# Altium schematic sheet DAC.SchDoc: xcore.ai Multi Channel Audio
size 408 x 287 mm; DocumentNumber: 3; Revision: 1V1; SheetNumber: 3; SheetTotal: 8
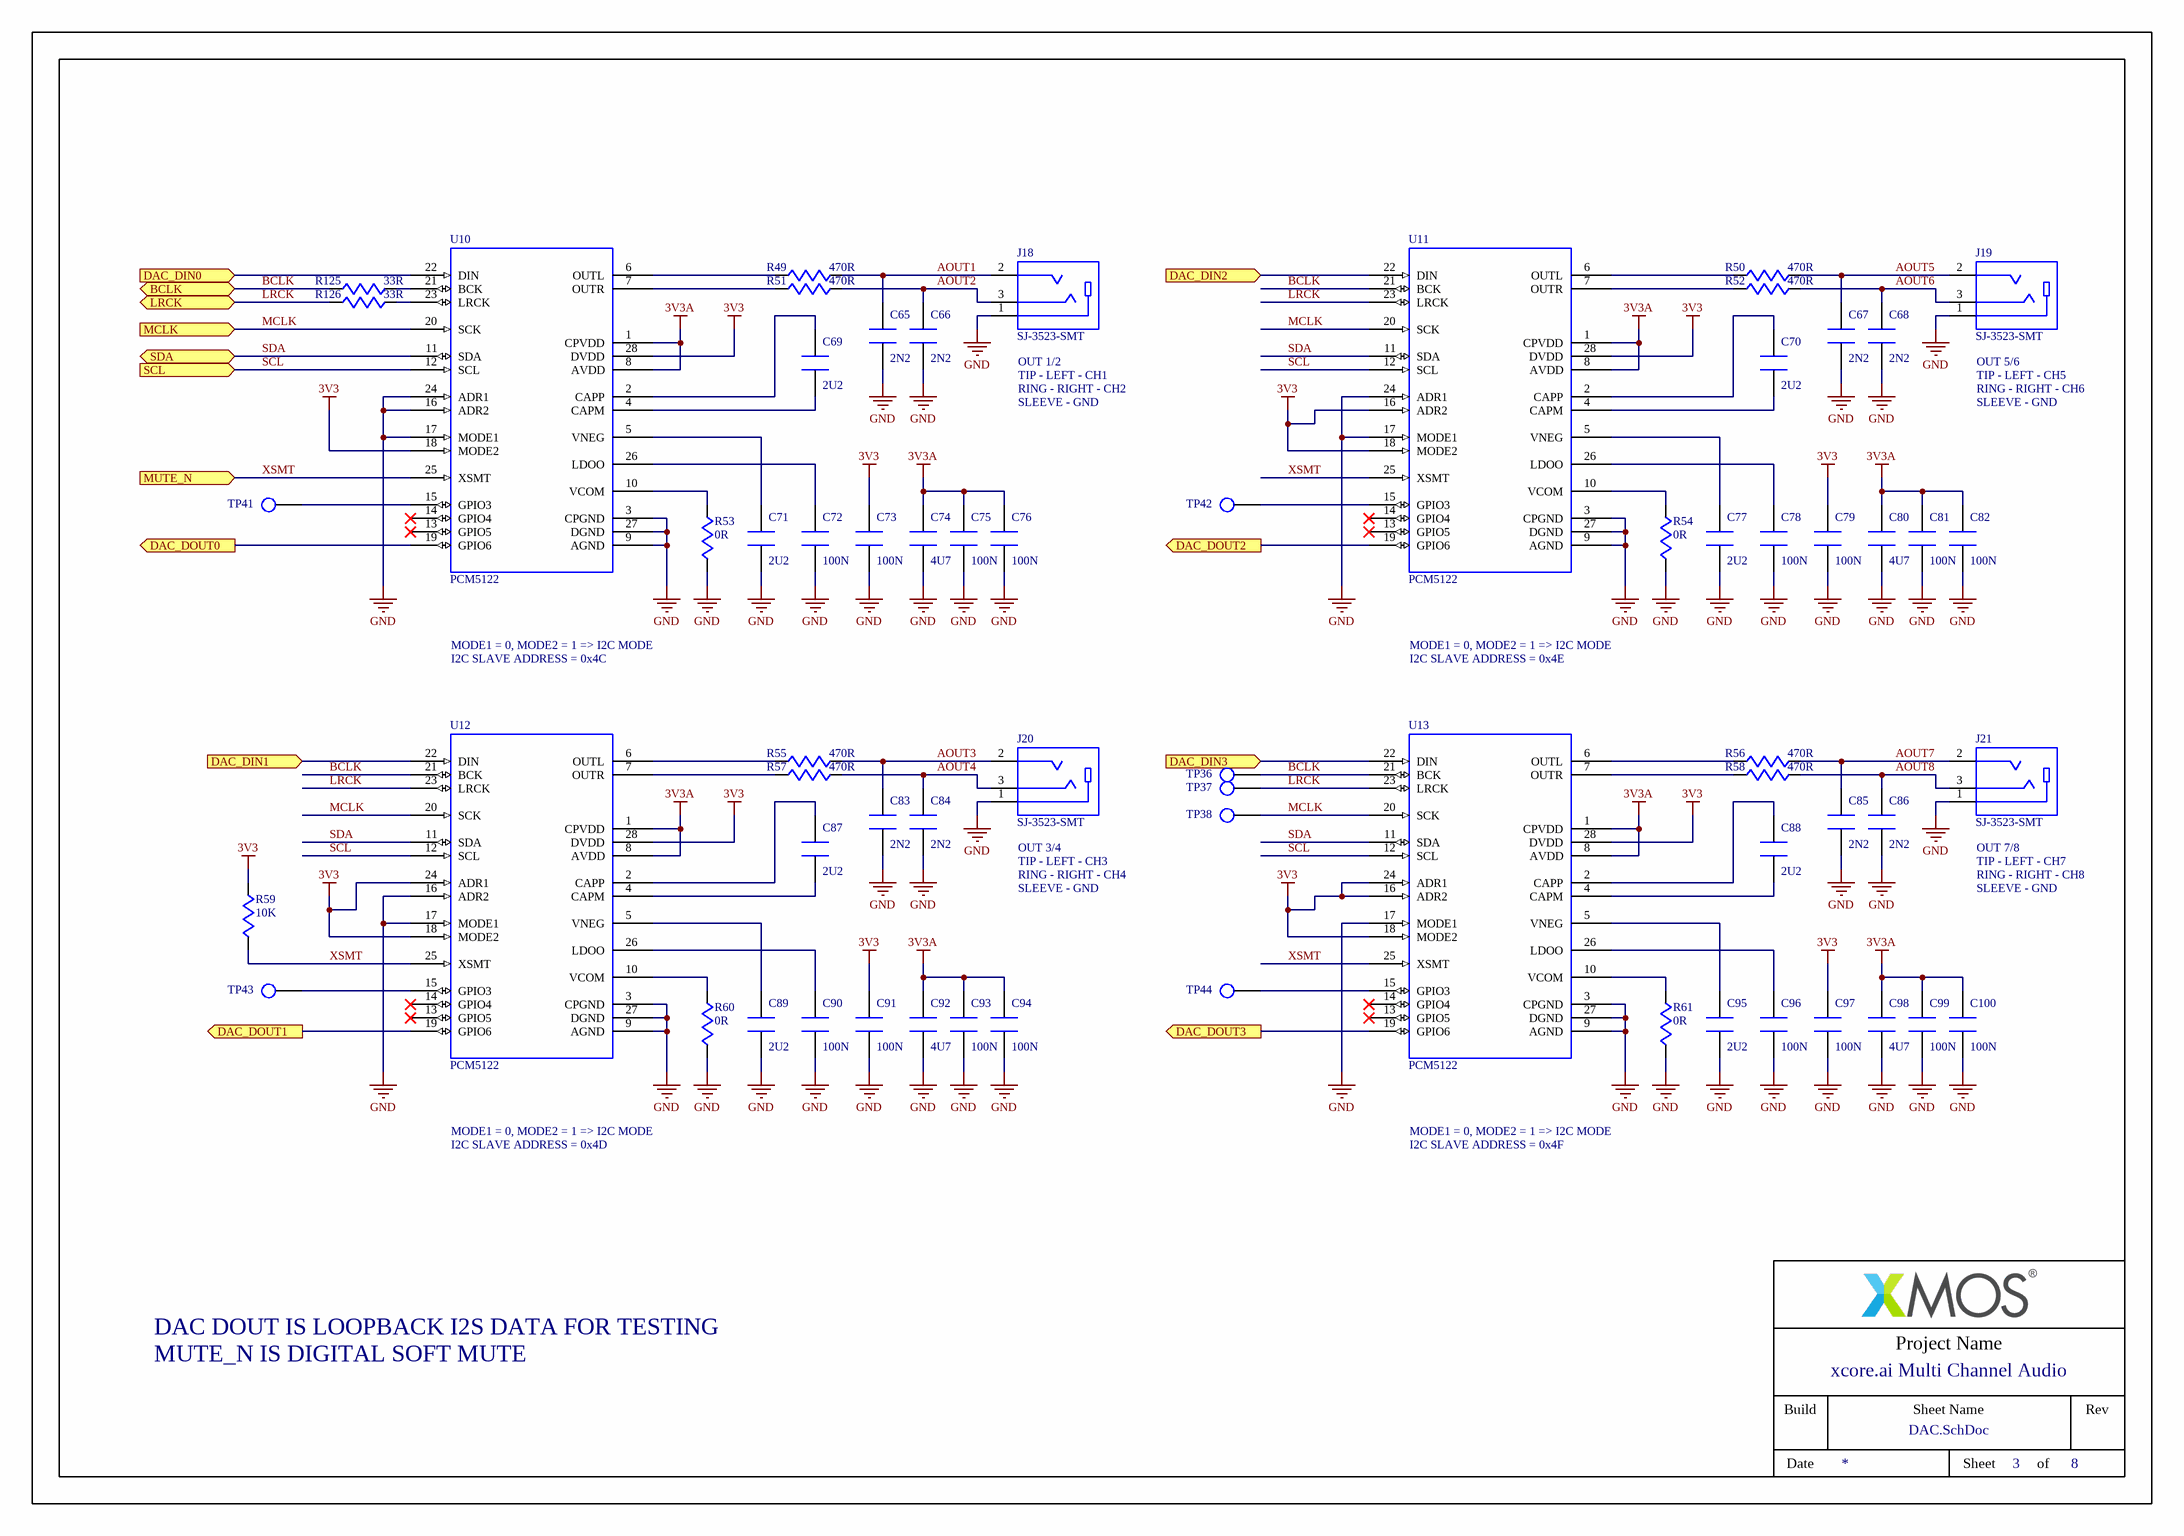
[diagram p0: DAC.SchDoc]

## Parts
C65  2N2  [CAPC1608X90N]
C66  2N2  [CAPC1608X90N]
C67  2N2  [CAPC1608X90N]
C68  2N2  [CAPC1608X90N]
C69  2U2  [CAPC1608X90N]
C70  2U2  [CAPC1608X90N]
C71  2U2  [CAPC1608X90N]
C72  100N  [CAPC1005X55N]
C73  100N  [CAPC1005X55N]
C74  4U7  [CAPC1608X90N]
C75  100N  [CAPC1005X55N]
C76  100N  [CAPC1005X55N]
C77  2U2  [CAPC1608X90N]
C78  100N  [CAPC1005X55N]
C79  100N  [CAPC1005X55N]
C80  4U7  [CAPC1608X90N]
C81  100N  [CAPC1005X55N]
C82  100N  [CAPC1005X55N]
C83  2N2  [CAPC1608X90N]
C84  2N2  [CAPC1608X90N]
C85  2N2  [CAPC1608X90N]
C86  2N2  [CAPC1608X90N]
C87  2U2  [CAPC1608X90N]
C88  2U2  [CAPC1608X90N]
C89  2U2  [CAPC1608X90N]
C90  100N  [CAPC1005X55N]
C91  100N  [CAPC1005X55N]
C92  4U7  [CAPC1608X90N]
C93  100N  [CAPC1005X55N]
C94  100N  [CAPC1005X55N]
C95  2U2  [CAPC1608X90N]
C96  100N  [CAPC1005X55N]
C97  100N  [CAPC1005X55N]
C98  4U7  [CAPC1608X90N]
C99  100N  [CAPC1005X55N]
C100  100N  [CAPC1005X55N]
J18  SJ-3523-SMT  [CON_CUI_SJ3523]
J19  SJ-3523-SMT  [CON_CUI_SJ3523]
J20  SJ-3523-SMT  [CON_CUI_SJ3523]
J21  SJ-3523-SMT  [CON_CUI_SJ3523]
R49  470R  [RESC1608X55N]
R50  470R  [RESC1608X55N]
R51  470R  [RESC1608X55N]
R52  470R  [RESC1608X55N]
R53  0R  [RESC1608X55N]
R54  0R  [RESC1608X55N]
R55  470R  [RESC1608X55N]
R56  470R  [RESC1608X55N]
R57  470R  [RESC1608X55N]
R58  470R  [RESC1608X55N]
R59  10K  [RESC1608X55N]
R60  0R  [RESC1608X55N]
R61  0R  [RESC1608X55N]
R125  33R  [RESC1608X55N]
R126  33R  [RESC1608X55N]
TP36  TESTPOINT  [TESTPOINT_SMD_0.9MM_L]  (value not drawn)  (no BOM)
TP37  TESTPOINT  [TESTPOINT_SMD_0.9MM_L]  (value not drawn)  (no BOM)
TP38  TESTPOINT  [TESTPOINT_SMD_0.9MM_L]  (value not drawn)  (no BOM)
TP41  TESTPOINT  [TESTPOINT_SMD_0.9MM_L]  (value not drawn)  (no BOM)
TP42  TESTPOINT  [TESTPOINT_SMD_0.9MM_L]  (value not drawn)  (no BOM)
TP43  TESTPOINT  [TESTPOINT_SMD_0.9MM_L]  (value not drawn)  (no BOM)
TP44  TESTPOINT  [TESTPOINT_SMD_0.9MM_L]  (value not drawn)  (no BOM)
U10  PCM5122  [SOP65P640X120-28N]
U11  PCM5122  [SOP65P640X120-28N]
U12  PCM5122  [SOP65P640X120-28N]
U13  PCM5122  [SOP65P640X120-28N]

## Ports
BCLK (bidir), DAC_DIN0 (in), DAC_DIN1 (in), DAC_DIN2 (in), DAC_DIN3 (in), DAC_DOUT0 (out), DAC_DOUT1 (out), DAC_DOUT2 (out), DAC_DOUT3 (out), LRCK (bidir), MCLK (in), MUTE_N (in), SCL (in), SDA (bidir)

## Nets
3V3: C73.1 C79.1 C91.1 C97.1 R59.2 U10.18(MODE2) U10.28(DVDD) U11.16(ADR2) U11.18(MODE2) U11.28(DVDD) U12.18(MODE2) U12.24(ADR1) U12.28(DVDD) U13.16(ADR2) U13.18(MODE2) U13.24(ADR1) U13.28(DVDD)
3V3A: C74.1 C75.1 C76.1 C80.1 C81.1 C82.1 C92.1 C93.1 C94.1 C98.1 C99.1 C100.1 U10.1(CPVDD) U10.8(AVDD) U11.1(CPVDD) U11.8(AVDD) U12.1(CPVDD) U12.8(AVDD) U13.1(CPVDD) U13.8(AVDD)
GND: C65.2 C66.2 C67.2 C68.2 C71.2 C72.2 C73.2 C74.2 C75.2 C76.2 C77.2 C78.2 C79.2 C80.2 C81.2 C82.2 C83.2 C84.2 C85.2 C86.2 C89.2 C90.2 C91.2 C92.2 C93.2 C94.2 C95.2 C96.2 C97.2 C98.2 C99.2 C100.2 J18.1 J19.1 J20.1 J21.1 R53.1 R54.1 R60.1 R61.1 U10.3(CPGND) U10.9(AGND) U10.16(ADR2) U10.17(MODE1) U10.24(ADR1) U10.27(DGND) U11.3(CPGND) U11.9(AGND) U11.17(MODE1) U11.24(ADR1) U11.27(DGND) U12.3(CPGND) U12.9(AGND) U12.16(ADR2) U12.17(MODE1) U12.27(DGND) U13.3(CPGND) U13.9(AGND) U13.17(MODE1) U13.27(DGND)
AOUT1: C65.1 J18.2 R49.2
AOUT2: C66.1 J18.3 R51.2
AOUT3: C83.1 J20.2 R55.2
AOUT4: C84.1 J20.3 R57.2
AOUT5: C67.1 J19.2 R50.2
AOUT6: C68.1 J19.3 R52.2
AOUT7: C85.1 J21.2 R56.2
AOUT8: C86.1 J21.3 R58.2
BCLK: R125.1 TP36.1 U11.21(BCK) U12.21(BCK) U13.21(BCK) ; port BCLK
DAC_DIN0: U10.22(DIN) ; port DAC_DIN0
DAC_DIN1: U12.22(DIN) ; port DAC_DIN1
DAC_DIN2: U11.22(DIN) ; port DAC_DIN2
DAC_DIN3: U13.22(DIN) ; port DAC_DIN3
DAC_DOUT0: U10.19(GPIO6) ; port DAC_DOUT0
DAC_DOUT1: U12.19(GPIO6) ; port DAC_DOUT1
DAC_DOUT2: U11.19(GPIO6) ; port DAC_DOUT2
DAC_DOUT3: U13.19(GPIO6) ; port DAC_DOUT3
LRCK: R126.1 TP37.1 U11.23(LRCK) U12.23(LRCK) U13.23(LRCK) ; port LRCK
MCLK: TP38.1 U10.20(SCK) U11.20(SCK) U12.20(SCK) U13.20(SCK) ; port MCLK
SCL: U10.12(SCL) U11.12(SCL) U12.12(SCL) U13.12(SCL) ; port SCL
SDA: U10.11(SDA) U11.11(SDA) U12.11(SDA) U13.11(SDA) ; port SDA
XSMT: R59.1 U10.25(XSMT) U11.25(XSMT) U12.25(XSMT) U13.25(XSMT) ; port MUTE_N
NetC69_1: C69.1 U10.2(CAPP)
NetC69_2: C69.2 U10.4(CAPM)
NetC70_1: C70.1 U11.2(CAPP)
NetC70_2: C70.2 U11.4(CAPM)
NetC71_1: C71.1 U10.5(VNEG)
NetC72_1: C72.1 U10.26(LDOO)
NetC77_1: C77.1 U11.5(VNEG)
NetC78_1: C78.1 U11.26(LDOO)
NetC87_1: C87.1 U12.2(CAPP)
NetC87_2: C87.2 U12.4(CAPM)
NetC88_1: C88.1 U13.2(CAPP)
NetC88_2: C88.2 U13.4(CAPM)
NetC89_1: C89.1 U12.5(VNEG)
NetC90_1: C90.1 U12.26(LDOO)
NetC95_1: C95.1 U13.5(VNEG)
NetC96_1: C96.1 U13.26(LDOO)
NetR49_1: R49.1 U10.6(OUTL)
NetR50_1: R50.1 U11.6(OUTL)
NetR51_1: R51.1 U10.7(OUTR)
NetR52_1: R52.1 U11.7(OUTR)
NetR53_2: R53.2 U10.10(VCOM)
NetR54_2: R54.2 U11.10(VCOM)
NetR55_1: R55.1 U12.6(OUTL)
NetR56_1: R56.1 U13.6(OUTL)
NetR57_1: R57.1 U12.7(OUTR)
NetR58_1: R58.1 U13.7(OUTR)
NetR60_2: R60.2 U12.10(VCOM)
NetR61_2: R61.2 U13.10(VCOM)
NetR125_2: R125.2 U10.21(BCK)
NetR126_2: R126.2 U10.23(LRCK)
NetTP41_1: TP41.1 U10.15(GPIO3)
NetTP42_1: TP42.1 U11.15(GPIO3)
NetTP43_1: TP43.1 U12.15(GPIO3)
NetTP44_1: TP44.1 U13.15(GPIO3)

Not connected (* = marked no-connect by the designer): U10 13(GPIO5)* 14(GPIO4)*; U11 13(GPIO5)* 14(GPIO4)*; U12 13(GPIO5)* 14(GPIO4)*; U13 13(GPIO5)* 14(GPIO4)*

## Notes on the sheet
- (near J18) OUT 1/2
- TIP - LEFT - CH1
- RING - RIGHT - CH2
- SLEEVE - GND
- (near J19) OUT 5/6
- TIP - LEFT - CH5
- RING - RIGHT - CH6
- I2C SLAVE ADDRESS = 0x4C
- MODE1 = 0, MODE2 = 1 => I2C MODE
- I2C SLAVE ADDRESS = 0x4E
- (near J20) OUT 3/4
- TIP - LEFT - CH3
- RING - RIGHT - CH4
- (near J21) OUT 7/8
- TIP - LEFT - CH7
- RING - RIGHT - CH8
- I2C SLAVE ADDRESS = 0x4D
- I2C SLAVE ADDRESS = 0x4F
- DAC DOUT IS LOOPBACK I2S DATA FOR TESTING
- MUTE_N IS DIGITAL SOFT MUTE
- Project Name
- Build
- Sheet Name
- Rev
- Date
- Sheet
- of

## Library data of the parts
C65-C68 C83-C86 = STD-06-0063: CHIP CAPACITOR, CERAMIC, 2.2NF, 50V, 5%, NP0, 0603; Manufacturer: Murata; Manufacturer Part Number: GRM1885C1H222JA01D; Approx Volume Cost ($): 0.01; VALUE: 2N2; Part Number: STD-06-0063; Dielectric: NP0; Rated Voltage: 50V; Tolerance: 5%; Web Search Link: http://www.google.com/search?q=GRM1885C1H222JA01D
C69-C71 C77 C87-C89 C95 = STD-06-0152: CHIP CAPACITOR, CERAMIC, 2.2UF, 16V, 10%, X5R, 0603; Manufacturer: Yageo; Manufacturer Part Number: CC0603KRX5R7BB225; Approx Volume Cost ($): 0.033; VALUE: 2U2; Part Number: STD-06-0152; Dielectric: X5R; Rated Voltage: 16V; Tolerance: 10%; Web Search Link: http://www.google.com/search?q=CC0603KRX5R7BB225
C72 C73 C75 C76 C78 C79 C81 C82 C90 C91 C93 C94 C96 C97 C99 C100 = STD-06-0048: CHIP CAPACITOR, CERAMIC, 100NF, 16V, 10%, X7R, 0402; Manufacturer: Yageo; Manufacturer Part Number: CC0402KRX7R7BB104; Approx Volume Cost ($): 0.003; VALUE: 100N; Part Number: STD-06-0048; Dielectric: X7R; Rated Voltage: 16V; Tolerance: 10%; Web Search Link: http://www.google.com/search?q=CC0402KRX7R7BB104
C74 C80 C92 C98 = STD-06-0151: CHIP CAPACITOR, CERAMIC, 4.7UF, 16V, 10%, X5R, 0603; Manufacturer: Murata; Manufacturer Part Number: GRM188R61C475KE11D; Approx Volume Cost ($): 0.084; VALUE: 4U7; Part Number: STD-06-0151; Dielectric: X5R; Rated Voltage: 16V; Tolerance: 10%; Web Search Link: http://www.google.com/search?q=GRM188R61C475KE11D
J18-J21 = GEN-01-0021: TRS jack, 3.5mm, SMD; Manufacturer: CUI; Approx Volume Cost ($): 0.51; VALUE: SJ-3523-SMT; Part Number: GEN-01-0021; Manufacturer Part Number: SJ-3523-SMT; Web Search Link: http://www.google.com/search?q=SJ-3523-SMT
R49-R52 R55-R58 = STD-02-0054: CHIP RESISTOR, 470 OHM, 0.1W, 1%, 0603; Manufacturer: Yageo; Manufacturer Part Number: RC0603FR-07470RL; Max Voltage: 50V; Max Power: 100mW; Temperature Coefficient: ±100ppm/°C; Approx Volume Cost ($): 0.002; VALUE: 470R; Part Number: STD-02-0054; Tolerance: 1%; Web Search Link: http://www.google.com/search?q=RC0603FR-07470RL
R53 R54 R60 R61 = STD-02-0001: CHIP RESISTOR, ZERO OHM JUMPER, 1A, 0603; Manufacturer: Yageo; Manufacturer Part Number: RC0603JR-070RL; Tolerance: NA; Max Voltage: 50V; Approx Volume Cost ($): 0.002; VALUE: 0R; Part Number: STD-02-0001; Max Power: NA; Temperature Coefficient: NA; Web Search Link: http://www.google.com/search?q=RC0603JR-070RL
R59 = STD-02-0086: CHIP RESISTOR, 10K OHM, 0.1W, 1%, 0603; Manufacturer: Yageo; Manufacturer Part Number: RC0603FR-0710KL; Max Voltage: 50V; Max Power: 100mW; Temperature Coefficient: ±100ppm/°C; Approx Volume Cost ($): 0.002; VALUE: 10K; Part Number: STD-02-0086; Tolerance: 1%; Web Search Link: http://www.google.com/search?q=RC0603FR-0710KL
R125 R126 = STD-02-0026: CHIP RESISTOR, 33 OHM, 0.1W, 1%, 0603; Manufacturer: Yageo; Manufacturer Part Number: RC0603FR-0733RL; Max Voltage: 50V; Max Power: 100mW; Temperature Coefficient: ±100ppm/°C; Approx Volume Cost ($): 0.002; VALUE: 33R; Part Number: STD-02-0026; Tolerance: 1%; Web Search Link: http://www.google.com/search?q=RC0603FR-0733RL
TP36-TP38 TP41-TP44 = GEN-24-0019: Testpoint, SMD, 0.9mm; Manufacturer: NA; VALUE: TESTPOINT; Part Number: GEN-24-0019; Manufacturer Part Number: NA; Approx Volume Cost ($): NA
U10-U13 = GEN-06-0001: Stereo Audio DAC, 32 bit/384kHz, 112dB SNR, PLL, 2Vrms Output, TSSOP28; Manufacturer: Texas Instruments; Manufacturer Part Number: PCM5122PW; Approx Volume Cost ($): 3.3; VALUE: PCM5122; Part Number: GEN-06-0001; Web Search Link: http://www.google.com/search?q=PCM5122PW